# Altium schematic sheet [07]-MCU.SchDoc: MCU
size A3; Organization: Toradex AG; Address1: Altsagenstrasse 5; Address2: Horw; Address3: 6048; Address4: Switzerland; DocumentNumber: 6; Revision: V3.2; SheetNumber: 6; SheetTotal: 13; PageSetup: Record=PageOptions|CenterHorizontal=True|CenterVertical=True|PrintScale=0.73|XCorrection=1.00|YCorrection=1.00|PrintKind=0|BorderSize=5000000|LeftOffset=0|BottomOffset=0|Orientation=2|PaperLength=1000|PaperWidth=1000|Scale=100|PaperSource=7|PrintQuality=600|MediaType=1|DitherType=10|PaperKind=A4|PrintScaleMode=1
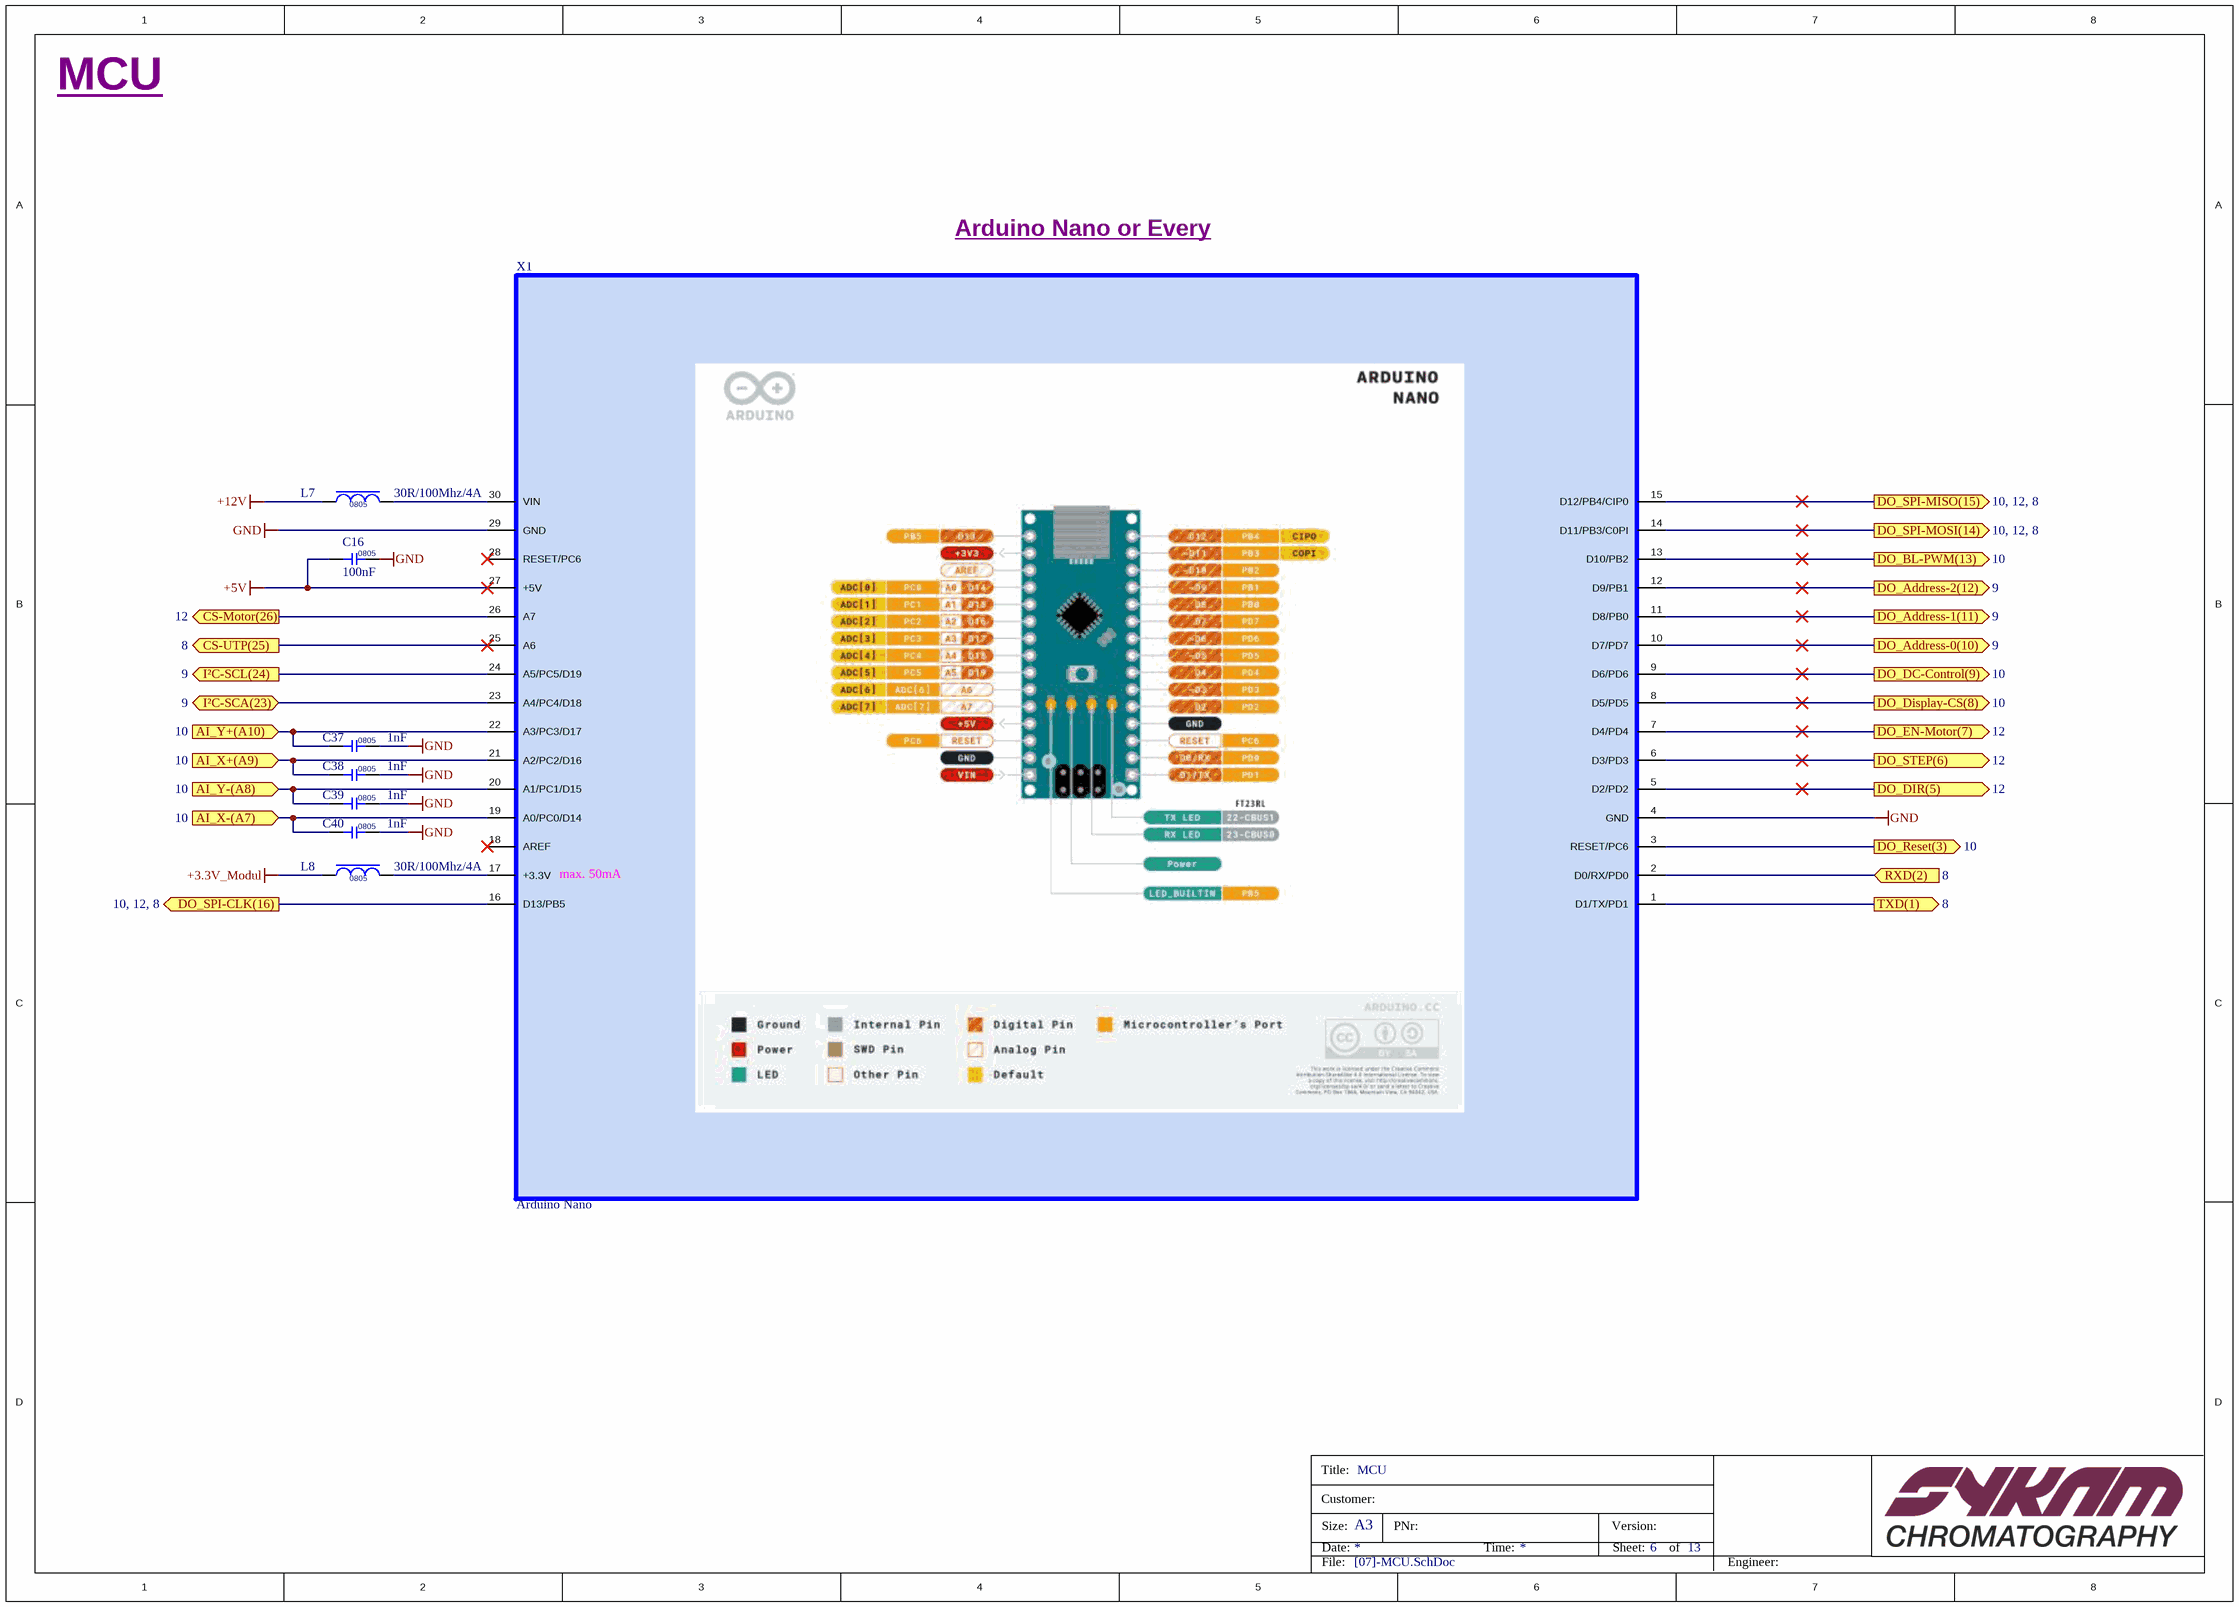
[diagram p0: [07]-MCU.SchDoc]

## Parts
C16  100nF  [C0805]
C37  1nF  [C0805]
C38  1nF  [C0805]
C39  1nF  [C0805]
C40  1nF  [C0805]
L7  30R/100Mhz/4A  [L0805]
L8  30R/100Mhz/4A  [L0805]
X1  Arduino Nano  [Arduino-Nano-Connectors]

## Ports
AI_X+(A9) (in, see 10), AI_X-(A7) (in, see 10), AI_Y+(A10) (in, see 10), AI_Y-(A8) (in, see 10), CS-Motor(26) (out, see 12), CS-UTP(25) (out, see 8), DO_Address-0(10) (out, see 9), DO_Address-1(11) (out, see 9), DO_Address-2(12) (out, see 9), DO_BL-PWM(13) (out, see 10), DO_DC-Control(9) (out, see 10), DO_DIR(5) (out, see 12), DO_Display-CS(8) (out, see 10), DO_EN-Motor(7) (out, see 12), DO_Reset(3) (out, see 10), DO_SPI-CLK(16) (out, see 10, 12, 8), DO_SPI-MISO(15) (out, see 10, 12, 8), DO_SPI-MOSI(14) (out, see 10, 12, 8), DO_STEP(6) (out, see 12), I²C-SCA(23) (bidir, see 9), I²C-SCL(24) (out, see 9), RXD(2) (in, see 8), TXD(1) (out, see 8)

## Nets
+3.3V_Modul: L8.1
+5V: C16.1 X1.27(+5V)
+12V: L7.1
GND: C16.2 C37.2 C38.2 C39.2 C40.2 X1.4(GND) X1.29(GND)
AI_X+(A9): C38.1 X1.21(A2/PC2/D16) ; port AI_X+(A9)
AI_X-(A7): C40.1 X1.19(A0/PC0/D14) ; port AI_X-(A7)
AI_Y+(A10): C37.1 X1.22(A3/PC3/D17) ; port AI_Y+(A10)
AI_Y-(A8): C39.1 X1.20(A1/PC1/D15) ; port AI_Y-(A8)
CS-Motor(26): X1.26(A7) ; port CS-Motor(26)
CS-UTP(25): X1.25(A6) ; port CS-UTP(25)
DO_Address-0(10): X1.10(D7/PD7) ; port DO_Address-0(10)
DO_Address-1(11): X1.11(D8/PB0) ; port DO_Address-1(11)
DO_Address-2(12): X1.12(D9/PB1) ; port DO_Address-2(12)
DO_BL-PWM(13): X1.13(D10/PB2) ; port DO_BL-PWM(13)
DO_DC-Control(9): X1.9(D6/PD6) ; port DO_DC-Control(9)
DO_DIR(5): X1.5(D2/PD2) ; port DO_DIR(5)
DO_Display-CS(8): X1.8(D5/PD5) ; port DO_Display-CS(8)
DO_EN-Motor(7): X1.7(D4/PD4) ; port DO_EN-Motor(7)
DO_Reset(3): X1.3(RESET/PC6) ; port DO_Reset(3)
DO_SPI-CLK(16): X1.16(D13/PB5) ; port DO_SPI-CLK(16)
DO_SPI-MISO(15): X1.15(D12/PB4/CIP0) ; port DO_SPI-MISO(15)
DO_SPI-MOSI(14): X1.14(D11/PB3/C0PI) ; port DO_SPI-MOSI(14)
DO_STEP(6): X1.6(D3/PD3) ; port DO_STEP(6)
I²C-SCA(23): X1.23(A4/PC4/D18) ; port I²C-SCA(23)
I²C-SCL(24): X1.24(A5/PC5/D19) ; port I²C-SCL(24)
RXD(2): X1.2(D0/RX/PD0) ; port RXD(2)
TXD(1): X1.1(D1/TX/PD1) ; port TXD(1)
NetL7_2: L7.2 X1.30(VIN)
NetL8_2: L8.2 X1.17(+3.3V)

Not connected (* = marked no-connect by the designer): X1 18(AREF)* 28(RESET/PC6)*

## Notes on the sheet
- Arduino Nano or Every
- (near X1) max. 50mA
- Title:
- Customer:
- Size:
- Date:
- A3
- PNr:
- Time:
- Version:
- Sheet:
- of
- File:
- Engineer:
- Title
- Number:
- Revision:
- Sheet

## Library data of the parts
C16 = C_100nF_CC0805KRX7R9BB104: CAP CER 0.1UF 50V X7R 0805; Manufacturer: Yageo; Material: Ceramic; Tolerance: 10%; Insulation Resistance: 100GR; PCBChecked: initials after Checked; Supplier 1: Digi-Key; Manufacturer Part Number: CC0805KRX7R9BB104; RoHS: Yes; Category: Ceramic Capacitors; Mount: Surface Mount; Case/Package: 0805; Number of Pins: 2; Case Code (Metric): 2012; Case Code (Imperial): 0805; Min Operating Temperature: -55°C; Max Operating Temperature: 125°C; Packaging: Tape and Reel; Capacitance: 100nF; Voltage Rating: 50V; Package Quantity: 1; Dielectric: X7R; Termination: SMD/SMT; Voltage: 50V; Length: 2mm; Height: 0.85mm; Width: 0.049inch; Thickness: 0.033inch; Depth: 1.25mm; Radiation Hardening: No; REACH SVHC: No SVHC; Lead Free: Lead Free; Halogen Free: Halogen Free; ComponentLink1URL: https://datasheet.ciiva.com/11786/0900766b80d84f1d-11786009.pdf?src-supplier=RSComponents; ComponentLink1Description: https://datasheet.ciiva.com/11786/0900766b80d84f1d-11786009.pdf?src-supplier=RSComponents; ComponentLink2URL: https://datasheet.ciiva.com/11464/upy-gphc-x7r-6-3v-to-50v-8-11464757.pdf?src-supplier=Avnet; ComponentLink2Description: https://datasheet.ciiva.com/11464/upy-gphc-x7r-6-3v-to-50v-8-11464757.pdf?src-supplier=Avnet; ComponentLink3URL: https://datasheet.ciiva.com/28450/1489800-28450805.pdf?src-supplier=Element14; ComponentLink3Description: https://datasheet.ciiva.com/28450/1489800-28450805.pdf?src-supplier=Element14; ComponentLink4URL: https://datasheet.ciiva.com/155/mlccorderingcode-155929.pdf?src-supplier=Digi-Key; ComponentLink4Description: https://datasheet.ciiva.com/155/mlccorderingcode-155929.pdf?src-supplier=Digi-Key; ComponentLink5URL: https://datasheet.ciiva.com/155/mlccorderingcode-155930.pdf?src-supplier=Digi-Key; ComponentLink5Description: https://datasheet.ciiva.com/155/mlccorderingcode-155930.pdf?src-supplier=Digi-Key; ComponentLink6URL: https://datasheet.ciiva.com/155/mlccorderingcode-155931.pdf?src-supplier=Digi-Key; ComponentLink6Description: https://datasheet.ciiva.com/155/mlccorderingcode-155931.pdf?src-supplier=Digi-Key; ComponentLink7URL: https://datasheet.ciiva.com/46393/1734573-46393307.pdf?src-supplier=Element14; ComponentLink7Description: https://datasheet.ciiva.com/46393/1734573-46393307.pdf?src-supplier=Element14; ComponentLink8URL: https://datasheet.ciiva.com/16625/upy-gphc-x7r-6-3v-to-50v-8-16625549.pdf?src-supplier=Avnet+Europe; ComponentLink8Description: https://datasheet.ciiva.com/16625/upy-gphc-x7r-6-3v-to-50v-8-16625549.pdf?src-supplier=Avnet+Europe; ComponentLink9URL: https://datasheet.ciiva.com/29242/445210-da-01-en-kerko-chip-0805-x7r-0-1uf-10proz-50vg-29242074.pdf?src-supplier=Conrad; ComponentLink9Description: https://datasheet.ciiva.com/29242/445210-da-01-en-kerko-chip-0805-x7r-0-1uf-10proz-50vg-29242074.pdf?src-supplier=Conrad; Supplier Part Number 1: 311-1140-6-ND; Stock 1: 7118979; IPC7352C: done; SCHChecked: Initials after checked
C37-C40 = C_1nF_C0805C102K5RAC7411: Multilayer Ceramic Capacitors MLCC - SMD/SMT 50volts 1000pF X7R 10%; Manufacturer: KEMET; Voltage Rating: 50V; Manufacturer Part Number: C0805C102K5RAC7411; RoHS: Yes; Category: Ceramic Capacitors; Stock 1: 30000; Pricing 1: 15000=0,01862, 30000=0,01764 (USD); Mount: Surface Mount; Case/Package: 0805; Case Code (Metric): 2012; Case Code (Imperial): 0805; Dielectric Material: Ceramic; Min Operating Temperature: -55°C; Max Operating Temperature: 125°C; Termination: SMD/SMT; Capacitance: 1nF; Package Quantity: 15000; Voltage Rating (DC): 50V; Tolerance: 10%; Packaging: Tape and Reel; Dielectric: X7R; Length: 0.079inch; Height: 0.78mm; Thickness: 0.035inch; Width: 0.049inch; ComponentLink1URL: http://components.arrow.com/part/dataview/0323_00324664?src-supplier=Arrow+Europe; ComponentLink1Description: http://components.arrow.com/part/dataview/0323_00324664?src-supplier=Arrow+Europe; ComponentLink2URL: http://www.mouser.com/ds/2/212/KEM_C1002_X7R_SMD-1102033.pdf?src-supplier=Mouser; ComponentLink2Description: http://www.mouser.com/ds/2/212/KEM_C1002_X7R_SMD-1102033.pdf?src-supplier=Mouser; ComponentLink3URL: https://api.kemet.com/component-edge/download/datasheet/C0805C102K5RAC7411.pdf?src-supplier=Digi-Key; ComponentLink3Description: https://api.kemet.com/component-edge/download/datasheet/C0805C102K5RAC7411.pdf?src-supplier=Digi-Key; Supplier 1: Digi-Key; Supplier Part Number 1: 311-1127-1-ND
L7 L8 = L_BLM21PG300SN1D: Ferrite Beads Multi-Layer 30Ohm 100MHz 4A 14mOhm DCR 0805 T/R; Manufacturer: Murata; Material: Steel,Ferrite; Resistance: 15mR; Tolerance: 25%; Impedance: 30R; Shielding: Unshielded; Number of Circuits: 1; DC Resistance (DCR): 14mR; Max DC Current: 3A; PCBChecked: initials after Checked; Supplier 1: Digi-Key; Manufacturer Part Number: BLM21PG300SN1D; RoHS: Yes; Category: Ferrite Beads and Chips; Case/Package: 0805; Number of Pins: 2; Core Material: Ferrite; Case Code (Metric): 2012; Case Code (Imperial): 0805; Min Operating Temperature: -55°C; Max Operating Temperature: 125°C; Frequency: 100MHz; Packaging: Tape and Reel; Package Quantity: 1; Max Current Rating: 4A; Number of Lines: 1; Termination: SMD/SMT; Test Frequency: 100MHz; DC Current: 3A; Military Standard: Not; Current Rating: 4A; Length: 2mm; Height: 0.85mm; Width: 1.25mm; Depth: 1.25mm; Radiation Hardening: No; Lead Free: Lead Free; REACH SVHC: No SVHC; ComponentLink1URL: https://datasheet.ciiva.com/11795/0900766b80021a8e-11795584.pdf?src-supplier=RSComponents; ComponentLink1Description: https://datasheet.ciiva.com/11795/0900766b80021a8e-11795584.pdf?src-supplier=RSComponents; ComponentLink2URL: https://datasheet.ciiva.com/19460/1845339-19460237.pdf?src-supplier=Jameco; ComponentLink2Description: https://datasheet.ciiva.com/19460/1845339-19460237.pdf?src-supplier=Jameco; ComponentLink3URL: https://datasheet.ciiva.com/25903/l0110s0100blm21p-25903510.pdf?src-supplier=Avnet+Europe; ComponentLink3Description: https://datasheet.ciiva.com/25903/l0110s0100blm21p-25903510.pdf?src-supplier=Avnet+Europe; ComponentLink4URL: https://datasheet.ciiva.com/3081/l0110s0100blm21p-3081657.pdf?src-supplier=Avnet; ComponentLink4Description: https://datasheet.ciiva.com/3081/l0110s0100blm21p-3081657.pdf?src-supplier=Avnet; ComponentLink5URL: https://datasheet.ciiva.com/16199/l0110s0100blm21p-16199625.pdf?src-supplier=Future+Electronics; ComponentLink5Description: https://datasheet.ciiva.com/16199/l0110s0100blm21p-16199625.pdf?src-supplier=Future+Electronics; ComponentLink6URL: https://datasheet.ciiva.com/3081/l0110s0100blm21p-3081658.pdf?src-supplier=Avnet; ComponentLink6Description: https://datasheet.ciiva.com/3081/l0110s0100blm21p-3081658.pdf?src-supplier=Avnet; ComponentLink7URL: https://datasheet.ciiva.com/6212/l0110s0100blm21p-6212358.pdf?src-supplier=Digi-Key; ComponentLink7Description: https://datasheet.ciiva.com/6212/l0110s0100blm21p-6212358.pdf?src-supplier=Digi-Key; ComponentLink8URL: https://datasheet.ciiva.com/6212/l0110s0100blm21p-6212360.pdf?src-supplier=Digi-Key; ComponentLink8Description: https://datasheet.ciiva.com/6212/l0110s0100blm21p-6212360.pdf?src-supplier=Digi-Key; ComponentLink9URL: https://datasheet.ciiva.com/8021/1756152-8021599.pdf?src-supplier=Element14; ComponentLink9Description: https://datasheet.ciiva.com/8021/1756152-8021599.pdf?src-supplier=Element14; ComponentLink10URL: https://datasheet.ciiva.com/41449/001172365-da-01-en-drossel-0805-30r0-2-0x1-25mm-4000st-41449606.pdf?src-supplier=Conrad; ComponentLink10Description: https://datasheet.ciiva.com/41449/001172365-da-01-en-drossel-0805-30r0-2-0x1-25mm-4000st-41449606.pdf?src-supplier=Conrad; Supplier Part Number 1: 490-1052-1-ND; Stock 1: 88452; IPC7352C: done; SCHChecked: Initials after checked
X1 = CON_Modul_ArduinoNano3: ATmega328 Microcontroller Development Board 16MHz CPU 2KB RAM 1KB/32KB EEPROM/Flash; Manufacturer Part Number: A000005; Operating Supply Voltage: 12V; Evaluation Kit: Yes; Interface: I2C,SPI,USB; Core Architecture: AVR; Number of Bits: 8; Data Bus Width: 8b; Supplier 1: Farnell; Manufacturer: Arduino; RoHS: Yes; Category: Embedded Processors and Controllers; Stock 1: 251; Pricing 1: 1=21,19000 (EUR); Weight: 0.358383oz; Package Quantity: 50; Packaging: Bulk; Series: AVR® ATmega; Length: 7inch; Width: 5inch; Height: 0.25inch; Reach SVHC Compliant: Yes; ComponentLink1URL: https://datasheet.ciiva.com/2398/arduinonanomanual23-2398236.pdf?src-supplier=Digi-Key; ComponentLink1Description: https://datasheet.ciiva.com/2398/arduinonanomanual23-2398236.pdf?src-supplier=Digi-Key; ComponentLink2URL: https://datasheet.ciiva.com/19455/2121148-19455443.pdf?src-supplier=Jameco; ComponentLink2Description: https://datasheet.ciiva.com/19455/2121148-19455443.pdf?src-supplier=Jameco; ComponentLink3URL: https://datasheet.ciiva.com/1336/1682238-1336473.pdf?src-supplier=Element14; ComponentLink3Description: https://datasheet.ciiva.com/1336/1682238-1336473.pdf?src-supplier=Element14; ComponentLink4URL: https://datasheet.ciiva.com/1414/810078-1414124.pdf?src-supplier=Newark; ComponentLink4Description: https://datasheet.ciiva.com/1414/810078-1414124.pdf?src-supplier=Newark; ComponentLink5URL: https://datasheet.ciiva.com/4926/arduino-arduinoboardnano-188748-4926316.pdf?src-supplier=Mouser; ComponentLink5Description: https://datasheet.ciiva.com/4926/arduino-arduinoboardnano-188748-4926316.pdf?src-supplier=Mouser; Supplier Part Number 1: 1848691